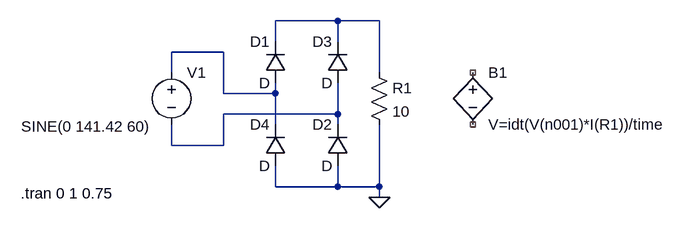
[diagram p0: schematic ex1.asc]
ex1.asc, the LTspice schematic file:
Version 4
SHEET 1 880 680
WIRE 48 -80 -48 -80
WIRE 112 -80 48 -80
WIRE -48 -48 -48 -80
WIRE 48 -48 48 -80
WIRE -128 -32 -208 -32
WIRE -208 0 -208 -32
WIRE 112 0 112 -80
WIRE -128 32 -128 -32
WIRE -48 32 -48 16
WIRE -48 32 -128 32
WIRE 48 64 48 16
WIRE 48 64 -128 64
WIRE -48 80 -48 32
WIRE 48 80 48 64
WIRE -208 112 -208 80
WIRE -128 112 -128 64
WIRE -128 112 -208 112
WIRE -48 176 -48 144
WIRE 48 176 48 144
WIRE 48 176 -48 176
WIRE 112 176 112 80
WIRE 112 176 48 176
WIRE 112 192 112 176
FLAG 112 192 0
SYMBOL diode -32 16 R180
WINDOW 0 24 64 Left 2
WINDOW 3 24 0 Left 2
SYMATTR InstName D1
SYMBOL diode 64 16 R180
WINDOW 0 24 64 Left 2
WINDOW 3 24 0 Left 2
SYMATTR InstName D3
SYMBOL diode -32 144 R180
WINDOW 0 24 64 Left 2
WINDOW 3 24 0 Left 2
SYMATTR InstName D4
SYMBOL diode 64 144 R180
WINDOW 0 24 64 Left 2
WINDOW 3 24 0 Left 2
SYMATTR InstName D2
SYMBOL voltage -208 -16 R0
WINDOW 3 -231 99 Left 2
WINDOW 123 0 0 Left 0
WINDOW 39 0 0 Left 0
SYMATTR InstName V1
SYMATTR Value SINE(0 141.42 60)
SYMBOL res 96 -16 R0
SYMATTR InstName R1
SYMATTR Value 10
SYMBOL bv 256 -16 R0
SYMATTR InstName B1
SYMATTR Value V=idt(V(n001)*I(R1))/time
TEXT -440 186 Left 2 !.tran 0 1 0.75

The netlist it stands for:
* ex1.asc
D1 N002 N001 D
D3 N003 N001 D
D4 0 N002 D
D2 0 N003 D
V1 N002 N003 SINE(0 141.42 60)
R1 N001 0 10
B1 NC_01 NC_02 V=idt(V(n001)*I(R1))/time
.model D D
.lib standard.dio
.tran 0 1 0.75
.backanno
.end